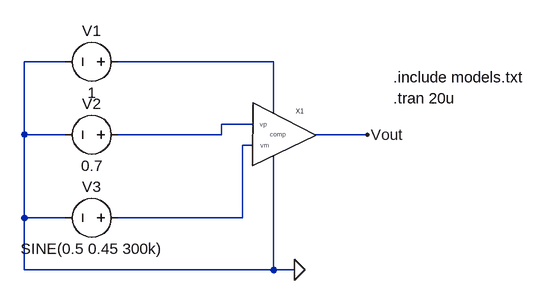
[diagram p0: schematic comparator_test.asc]
comparator_test.asc, the LTspice schematic file:
Version 4
SHEET 1 880 680
WIRE -144 32 -208 32
WIRE 176 32 -64 32
WIRE 176 112 176 32
WIRE 144 128 96 128
WIRE -208 144 -208 32
WIRE -144 144 -208 144
WIRE 96 144 96 128
WIRE 96 144 -64 144
WIRE 320 144 240 144
WIRE 144 160 128 160
WIRE -208 272 -208 144
WIRE -144 272 -208 272
WIRE 128 272 128 160
WIRE 128 272 -64 272
WIRE -208 352 -208 272
WIRE 176 352 176 176
WIRE 176 352 -208 352
WIRE 208 352 176 352
FLAG 208 352 0
FLAG 320 144 Vout
SYMBOL comparator 192 128 R0
SYMATTR InstName X1
SYMBOL voltage -48 32 R90
WINDOW 0 -32 56 VBottom 2
WINDOW 3 32 56 VTop 2
WINDOW 123 0 0 Left 0
WINDOW 39 0 0 Left 0
SYMATTR InstName V1
SYMATTR Value 1
SYMBOL voltage -48 144 R90
WINDOW 0 -32 56 VBottom 2
WINDOW 3 32 56 VTop 2
WINDOW 123 0 0 Left 0
WINDOW 39 0 0 Left 0
SYMATTR InstName V2
SYMATTR Value 0.7
SYMBOL voltage -48 272 R90
WINDOW 0 -32 56 VBottom 2
WINDOW 3 32 56 VTop 2
WINDOW 123 0 0 Left 0
WINDOW 39 0 0 Left 0
SYMATTR InstName V3
SYMATTR Value SINE(0.5 0.45 300k)
TEXT 360 56 Left 2 !.include models.txt
TEXT 360 88 Left 2 !.tran 20u

The netlist it stands for:
* comparator_test.asc
XX1 N002 N003 N001 0 Vout comparator  ; pins vp vm VHIGH VLOW Vout
V1 N001 0 1
V2 N002 0 0.7
V3 N003 0 SINE(0.5 0.45 300k)
.include models.txt
.tran 20u
.backanno
.end